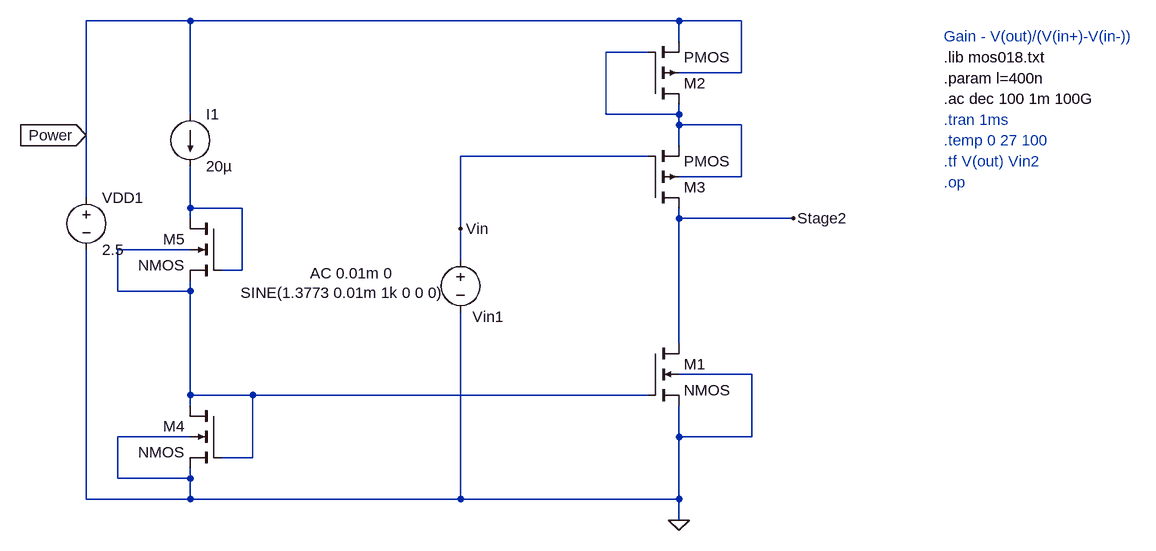
[diagram p0: schematic Stage 2.asc]
Stage 2.asc, the LTspice schematic file:
Version 4
SHEET 1 884 680
WIRE -576 -128 -736 -128
WIRE 176 -128 -576 -128
WIRE 272 -128 176 -128
WIRE 176 -96 176 -128
WIRE 128 -80 64 -80
WIRE 272 -48 272 -128
WIRE 272 -48 176 -48
WIRE -576 16 -576 -128
WIRE 64 16 64 -80
WIRE 176 16 176 0
WIRE 176 16 64 16
WIRE 176 32 176 16
WIRE 272 32 176 32
WIRE -736 48 -736 -128
WIRE 176 64 176 32
WIRE 128 80 -160 80
WIRE 272 112 272 32
WIRE 272 112 176 112
WIRE -736 144 -736 48
WIRE -576 160 -576 96
WIRE -496 160 -576 160
WIRE -576 176 -576 160
WIRE 176 176 176 160
WIRE 352 176 176 176
WIRE -160 192 -160 80
WIRE -576 224 -688 224
WIRE -160 240 -160 192
WIRE -496 256 -496 160
WIRE -496 256 -528 256
WIRE -688 288 -688 224
WIRE -576 288 -576 272
WIRE -576 288 -688 288
WIRE 176 368 176 176
WIRE 288 416 176 416
WIRE -576 448 -576 288
WIRE -480 448 -576 448
WIRE 128 448 -480 448
WIRE -576 464 -576 448
WIRE -576 512 -688 512
WIRE 176 512 176 464
WIRE 288 512 288 416
WIRE 288 512 176 512
WIRE -480 544 -480 448
WIRE -480 544 -528 544
WIRE -688 576 -688 512
WIRE -576 576 -576 560
WIRE -576 576 -688 576
WIRE -736 608 -736 224
WIRE -576 608 -576 576
WIRE -576 608 -736 608
WIRE -160 608 -160 320
WIRE -160 608 -576 608
WIRE 176 608 176 512
WIRE 176 608 -160 608
WIRE 176 640 176 608
FLAG 352 176 Stage2
FLAG 176 640 0
FLAG -160 192 Vin
FLAG -736 48 Power
IOPIN -736 48 In
SYMBOL nmos4 128 368 R0
SYMATTR InstName M1
SYMATTR Value2 l={l} w=5u
SYMBOL pmos4 128 0 M180
SYMATTR InstName M2
SYMATTR Value2 l={l} w=12.5u
SYMBOL pmos4 128 160 M180
SYMATTR InstName M3
SYMATTR Value2 l={l} w=5u
SYMBOL voltage -160 224 R0
WINDOW 0 42 88 Top 2
WINDOW 3 -182 82 Bottom 2
WINDOW 123 -168 52 Bottom 2
WINDOW 39 -1 235 VBottom 2
SYMATTR InstName Vin1
SYMATTR Value SINE(1.3773 0.01m 1k 0 0 0)
SYMATTR Value2 AC 0.01m 0
SYMBOL current -576 16 R0
WINDOW 123 0 0 Left 0
WINDOW 39 0 0 Left 0
SYMATTR InstName I1
SYMATTR Value 20µ
SYMBOL nmos4 -528 464 M0
SYMATTR InstName M4
SYMATTR Value2 l={l} w=10u
SYMBOL voltage -736 128 R0
WINDOW 123 0 0 Left 0
WINDOW 39 0 0 Left 0
SYMATTR InstName VDD1
SYMATTR Value 2.5
SYMBOL nmos4 -528 176 M0
SYMATTR InstName M5
SYMATTR Value2 l={l} w=1u
TEXT 584 24 Left 2 ;.tran 1ms
TEXT 584 56 Left 2 ;.temp 0 27 100
TEXT 584 -8 Left 2 !.ac dec 100 1m 100G
TEXT 584 -40 Left 2 !.param l=400n
TEXT 584 -72 Left 2 !.lib mos018.txt
TEXT 584 -104 Left 2 ;Gain - V(out)/(V(in+)-V(in-))
TEXT 584 120 Left 2 ;.op
TEXT 584 88 Left 2 ;.tf V(out) Vin2

The netlist it stands for:
* Stage 2.asc
M1 Stage2 N003 0 0 NMOS l={l} w=5u
M2 N001 N001 Power Power PMOS l={l} w=12.5u
M3 Stage2 Vin N001 N001 PMOS l={l} w=5u
Vin1 Vin 0 SINE(1.3773 0.01m 1k 0 0 0) AC 0.01m 0
I1 Power N002 20µ
M4 N003 N003 0 0 NMOS l={l} w=10u
VDD1 Power 0 2.5
M5 N002 N002 N003 N003 NMOS l={l} w=1u
.model NMOS NMOS
.model PMOS PMOS
.lib standard.mos
* .tran 1ms
* .temp 0 27 100
.ac dec 100 1m 100G
.param l=400n
.lib mos018.txt
* Gain - V(out)/(V(in+)-V(in-))
* .op
* .tf V(out) Vin2
.backanno
.end